# EAGLE design r2-led (EAGLE 5.11)
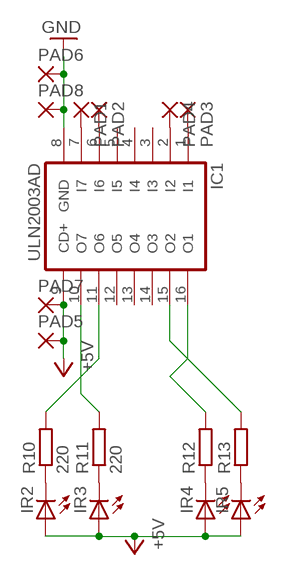
[diagram p0: schematic, sheet 1]

## Parts
IC1  ULN2003AD  [SO16]
IR2  LED3MM  [LED3MM]
IR3  LED3MM  [LED3MM]
IR4  LED3MM  [LED3MM]
IR5  LED3MM  [LED3MM]
PAD1  SMD2  [SMD1,27-2,54]
PAD2  SMD2  [SMD1,27-2,54]
PAD3  SMD2  [SMD1,27-2,54]
PAD4  SMD2  [SMD1,27-2,54]
PAD5  SMD2  [SMD1,27-2,54]
PAD6  SMD2  [SMD1,27-2,54]
PAD7  SMD2  [SMD1,27-2,54]
PAD8  SMD2  [SMD1,27-2,54]
R10  220  R-EU_R0805  [R0805]
R11  220  R-EU_R0805  [R0805]
R12  R-EU_R0805  [R0805]
R13  R-EU_R0805  [R0805]

## Nets
+5V: IC1.9(CD+) IR2.A IR3.A IR4.A IR5.A PAD5.1(P) PAD7.1(P)
GND: IC1.8(GND) PAD6.1(P) PAD8.1(P)
N$1: IC1.10(O7) R11.2
N$2: IC1.11(O6) R10.2
N$3: IC1.15(O2) R13.2
N$4: IC1.16(O1) R12.2
N$9: IR2.K(C) R10.1
N$10: IR3.K(C) R11.1
N$11: IR4.K(C) R12.1
N$12: IR5.K(C) R13.1
N$13: IC1.7(I7) PAD1.1(P)
N$17: IC1.6(I6) PAD2.1(P)
N$18: IC1.1(I1) PAD3.1(P)
N$19: IC1.2(I2) PAD4.1(P)
Unconnected: IC1.3(I3) IC1.4(I4) IC1.5(I5) IC1.12(O5) IC1.13(O4) IC1.14(O3)

## Library data of the parts
IC1 = uln-udn:ULN2003A: DRIVER ARRAY
IR2-IR5 = 0-svo:LED: LED OSRAM: - CHIPLED LG R971, LG N971, LY N971, LG Q971, LY Q971, LO R971, LY R971 LH N974, LH R974 LS Q976, LO Q976, LY Q976 LO Q996 - Hyper CHIPLED LW Q18S LB Q993, LB Q99A, LB R99A - SideLED LS A670, LO A670, LY A670, LG A670, LP A670 LB A673, LV A673, LT A673, LW A673 LH A674 LY A675 LS A676, LA A676, LO A676, LY A676, LW A676 LS A679, LY A679, LG A679 - Hyper Micro SIDELED® LS Y876, LA Y876, LO Y876, LY Y876 LT Y87S - SmartLED LW L88C, LW L88S LB L89C, LB L89S, LG L890 LS L89K, LO L89K, LY L89K LS L896, LA L896, LO L896, LY L896 - TOPLED LS T670, LO T670, LY T670, LG T670, LP T670 LSG T670, LSP T670, LSY T670, LOP T670, LYG T670 LG T671, LOG T671, LSG T671 LB T673, LV T673, LT T673, LW T673 LH T674 LS T676, LA T676, LO T676, LY T676, LB T676, LH T676, LSB T676, LW T676 LB T67C, LV T67C, LT T67C, LS T67K, LO T67K, LY T67K, LW E67C LS E67B, LA E67B, LO E67B, LY E67B, LB E67C, LV E67C, LT E67C LW T67C LS T679, LY T679, LG T679 LS T770, LO T770, LY T770, LG T770, LP T770 LB T773, LV T773, LT T773, LW T773 LH T774 LS E675, LA E675, LY E675, LS T675 LS T776, LA T776, LO T776, LY T776, LB T776 LHGB T686 LT T68C, LB T68C - Hyper Mini TOPLED® LB M676 - Mini TOPLED Santana® LG M470 LS M47K, LO M47K, LY M47K Source: http://www.osram.convergy.de/
PAD1-PAD8 = wirepad:SMD2: SMD PAD
R10-R13 = rcl:R-EU_: RESISTOR, European symbol

## Board
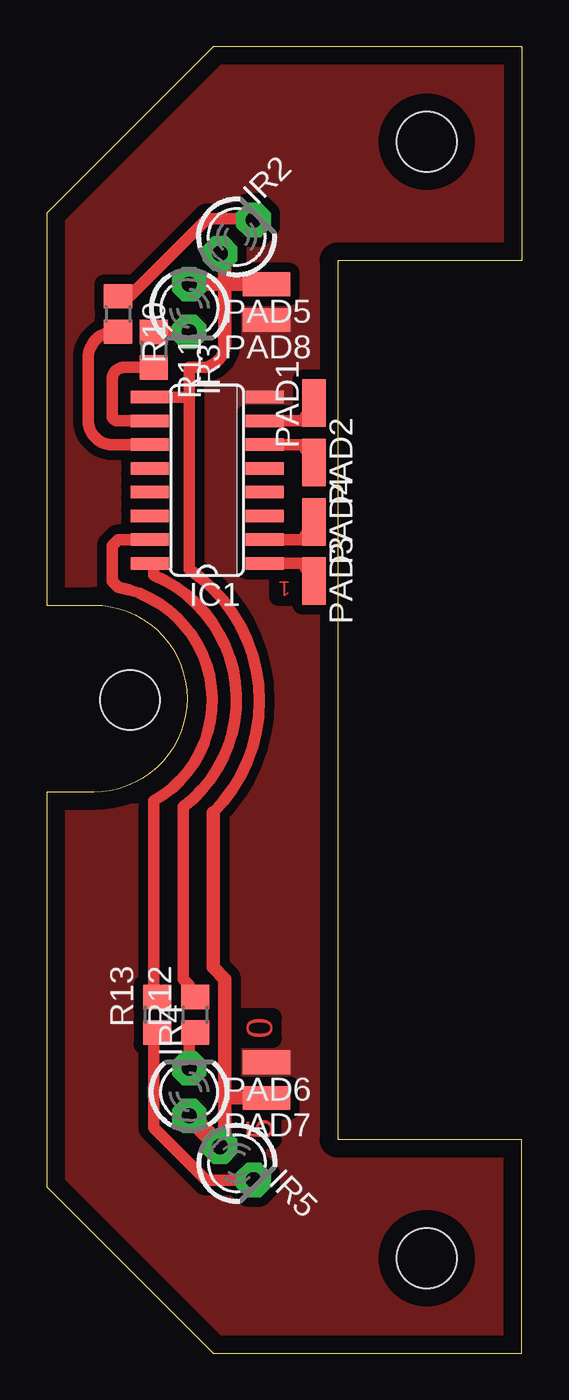
[diagram p1: board, top side]

Size 25.4 x 69.85 mm. Coordinates in mm from the lower left corner, seen from the top.
Outline: 8.89,0 25.4,0 25.4,11.43 15.56,11.43 15.56,58.42 25.4,58.42 25.4,69.85 8.89,69.85 0,60.96 0,40 2.5,40 arc-90 7.5,35 arc-90 2.5,30 0,30 0,8.89 8.89,0
Copper layers (1*16): Top 0.035mm / dielectric 1.5mm / Bottom 0.035mm
Design rules "default *": minimum track width 12mil, minimum drill 20mil, track to track 8mil, track to pad 8mil, pad to pad 8mil, via to via 8mil, smd to smd 8mil, copper to edge 38mil, drill to drill 8mil, minimum pad ring 20mil, minimum via ring 8mil, stop-mask expansion 4mil, vias tented up to drill 0mil, thermal gap 10mil
Holes 3.2 mm at 20.32,64.77 20.32,5.08 4.45,34.92
vRestrict: area 8.9,52.1 to 9.1,52.6

### Footprints (pad centres in the part's own frame; a part is rotated, then mirrored left to right if it is on the bottom)
SO16 = smd 0.66 x 2.032: 1 -4.445,-3.073; 2 -3.175,-3.073; 3 -1.905,-3.073; 4 -0.635,-3.073; 5 0.635,-3.073; 6 1.905,-3.073; 7 3.175,-3.073; 8 4.445,-3.073; 9 4.445,3.073; 10 3.175,3.073; 11 1.905,3.073; 12 0.635,3.073; 13 -0.635,3.073; 14 -1.905,3.073; 15 -3.175,3.073; 16 -4.445,3.073
LED3MM = drill 0.813 octagon: A -1.27,0; K 1.27,0
SMD1,27-2,54 = smd 1.27 x 2.54: 1 0,0
R0805 = smd 1.3 x 1.5: 1 -0.95,0; 2 0.95,0

### Placement (x,y rotation side)
IC1  8.57,46.67 90 top
IR2  10.16,59.69 45 top
IR3  7.62,55.88 270 top
IR4  7.62,13.97 90 top
IR5  10.16,10.16 315 top
PAD1  14.29,50.8 0 top
PAD2  14.29,47.62 180 top
PAD3  14.29,41.27 180 top
PAD4  14.29,44.45 180 top
PAD5  11.75,57.15 90 top
PAD6  11.75,15.56 90 top
PAD7  11.75,13.65 90 top
PAD8  11.75,55.24 90 top
R10  3.81,55.56 270 top
R11  5.71,53.66 270 top
R12  7.94,18.1 90 top
R13  5.91,18.1 90 top

### Tracks (layer width: path | path; a pad name or v marks a point on that pad's centre or on a via)
+5V
  Top 0.61: 8.89,28.89 arc101 7.62,41.91 7.62,51.12 | IR5.A 9.53,11.32 | 9.53,53.98 arc-90 8.26,52.7 7.62,52.7 7.62,51.12 | 7.62,51.12 IC1.9
  Top 0.711: 8.89,28.89 8.89,20.64 9.53,20 9.53,13.65 | 9.53,53.98 9.53,57.15 | 9.53,57.15 PAD5.1 | 9.53,57.15 9.53,58.53 IR2.A | 9.53,57.15 IR3.A | 9.53,11.32 9.53,13.65 | 9.53,13.65 PAD7.1
  Top 1.016: IR5.A 8.57,11.75 IR4.A
GND
  pour Top (isolate 0.508, rank 4, no thermals): -3.81,74.3 -3.81,3.17 1.27,-1.91 27.94,-1.91 31.11,1.27 31.11,69.85 24.77,76.2 -1.91,76.2
N$1
  Top 0.61: R11.2 4.13,52.71 arc90 3.49,52.07 3.49,50.16 arc90 3.81,49.85 IC1.10
N$2
  Top 0.61: IC1.11 3.49,48.58 arc-90 2.22,49.85 2.22,53.34 arc-90 R10.2
N$3
  Top 0.61: IC1.15 3.81,43.5 3.49,43.18 3.49,41.27 3.81,40.96 arc-140 5.71,29.53 5.71,19.05 R13.2
N$4
  Top 0.61: 7.62,19.05 R12.2 7.62,19.36 7.62,19.68 7.3,20 7.3,29.21 arc120 5.71,41.59 5.71,42.23 IC1.16
N$9
  Top 0.61: R10.1 4.44,56.51 8.57,60.64 11,60.64 IR2.K
N$10
  Top 0.61: IR3.K R11.1
N$11
  Top 0.61: IR4.K 7.62,16.83 arc-90 R12.1
N$12
  Top 0.61: R13.1 5.71,16.7 5.71,12.06 8.52,9.26 IR5.K
N$13
  Top 0.61: IC1.7 13.65,49.85 PAD1.1
N$17
  Top 0.61: IC1.6 13.65,48.58 PAD2.1
N$18
  Top 0.61: IC1.1 13.65,42.23 PAD3.1
N$19
  Top 0.61: IC1.2 13.65,43.5 PAD4.1

### Text on the board
Top: 1 | 0 | 5